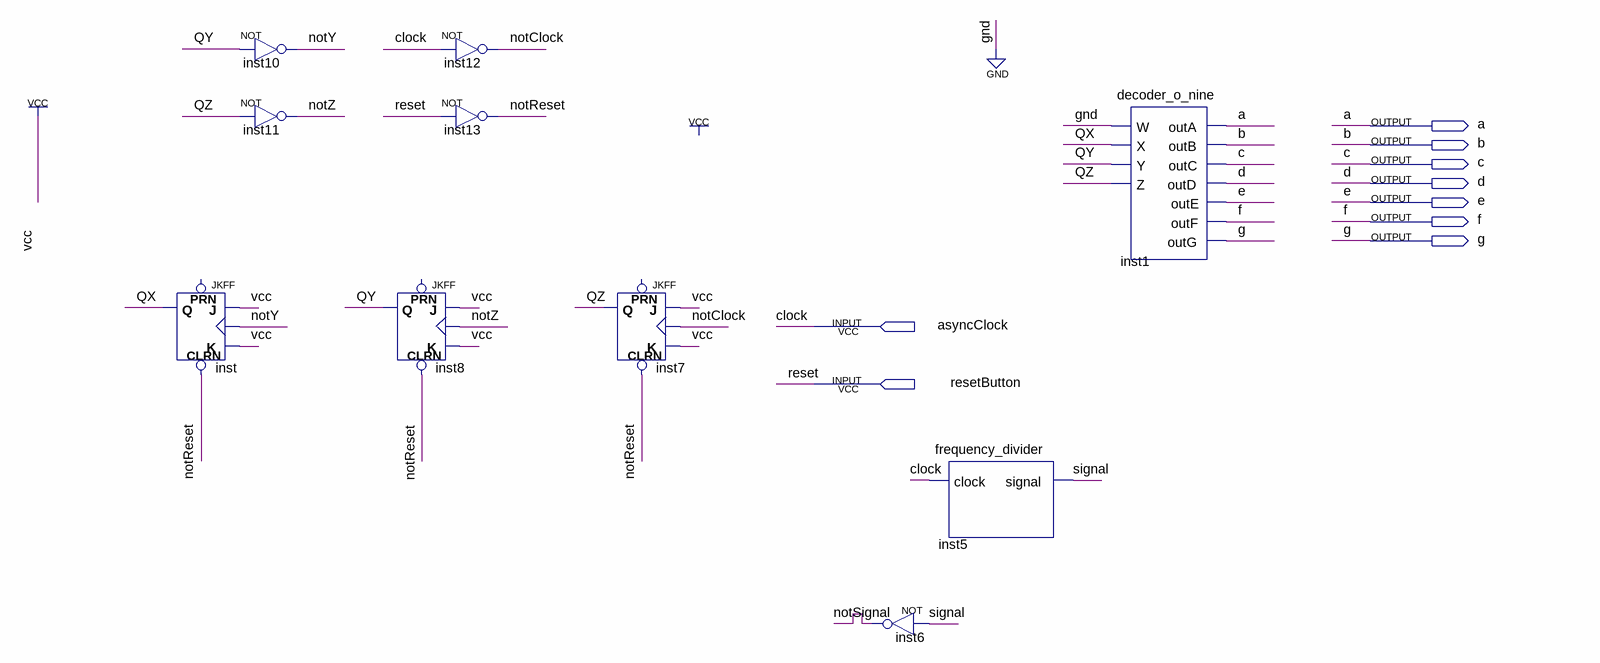
[diagram p0: schematic sheet]
// Quartus schematic auto_counter.bdf as structural Verilog: 10 symbols, 9 pins
module auto_counter (
  input  asyncClock,
  input  resetButton,
  output a,
  output b,
  output c,
  output d,
  output e,
  output f,
  output g
);

  wire notClock, notReset, notSignal, notY, notZ, QX, QY, QZ, signal;

  JKFF inst (.CLRN(notReset), .K(1'b1), .J(1'b1), .CLK(notY), .Q(QX));  // open: PRN
  not inst10 (notY, QY);
  not inst11 (notZ, QZ);
  JKFF inst8 (.CLRN(notReset), .K(1'b1), .J(1'b1), .CLK(notZ), .Q(QY));  // open: PRN
  not inst12 (notClock, asyncClock);
  not inst13 (notReset, resetButton);
  JKFF inst7 (.CLRN(notReset), .K(1'b1), .J(1'b1), .CLK(notClock), .Q(QZ));  // open: PRN
  not inst6 (notSignal, signal);
  frequency_divider inst5 (.clock(asyncClock), .signal(signal));
  decoder_o_nine inst1 (
    .W(1'b0), .X(QX), .Y(QY), .Z(QZ), .outA(a), .outB(b), .outC(c), .outD(d), .outE(e), .outF(f), .outG(g));

  // Other names for the same wires on the sheet: clock = asyncClock; reset = resetButton
endmodule
